# EAGLE design knightrider (EAGLE 7.2.0)
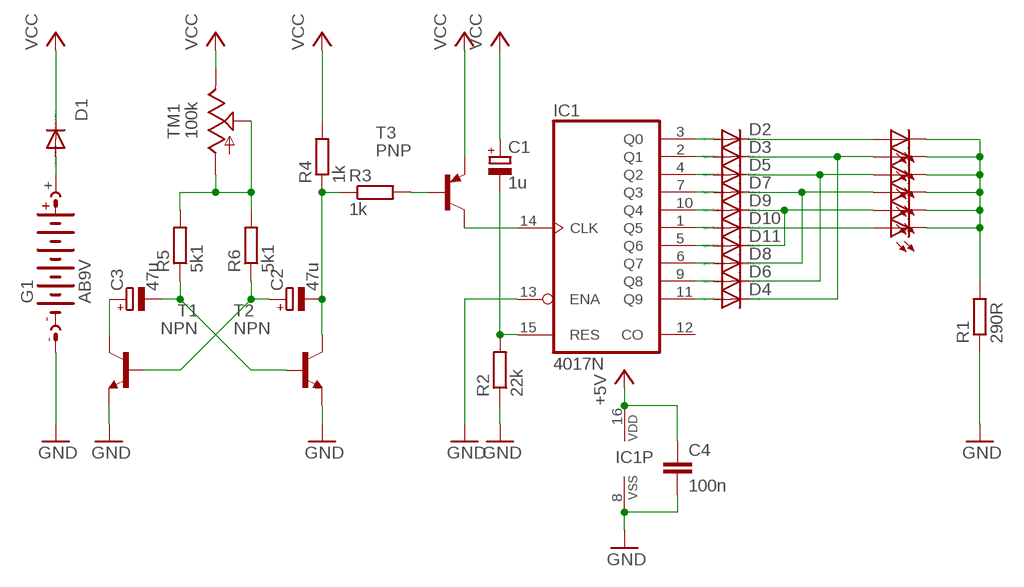
[diagram p0: schematic, sheet 1]

## Parts
C1  1u  CPOL-EUE2.5-6  [E2,5-6]
C2  47u  CPOL-EUE2.5-6  [E2,5-6]
C3  47u  CPOL-EUE2.5-6  [E2,5-6]
C4  100n  C-EU050-025X075  [C050-025X075]
D1  1N4148  1N4148DO35-7  [DO35-7]
D2  1N4148DO35-7  [DO35-7]
D3  1N4148DO35-7  [DO35-7]
D4  1N4148DO35-7  [DO35-7]
D5  1N4148DO35-7  [DO35-7]
D6  1N4148DO35-7  [DO35-7]
D7  1N4148DO35-7  [DO35-7]
D8  1N4148DO35-7  [DO35-7]
D9  1N4148DO35-7  [DO35-7]
D10  1N4148DO35-7  [DO35-7]
D11  1N4148DO35-7  [DO35-7]
G1  AB9V  [AB9V]
IC1  4017N  [DIL16]
LED1  LED5MM  [LED5MM]
LED2  LED5MM  [LED5MM]
LED3  LED5MM  [LED5MM]
LED4  LED5MM  [LED5MM]
LED5  LED5MM  [LED5MM]
LED6  LED5MM  [LED5MM]
R1  290R  R-EU_0204/7  [0204/7]
R2  22k  R-EU_0204/7  [0204/7]
R3  1k  R-EU_0204/7  [0204/7]
R4  1k  R-EU_0204/7  [0204/7]
R5  5k1  R-EU_0204/7  [0204/7]
R6  5k1  R-EU_0204/7  [0204/7]
T1  NPN  2N4401-NPN-TO92-EBC  [TO92-EBC]
T2  NPN  2N4401-NPN-TO92-EBC  [TO92-EBC]
T3  PNP  2N4403-PNP-TO92-EBC  [TO92-EBC]
TM1  100k  TRIM  [6MM]

## Nets
+5V: C1.+ C4.1 D1.C IC1.16(VDD) R4.2 T3.E TM1.E ; supply symbol labelled VCC
GND: C4.2 G1.- IC1.8(VSS) IC1.13(ENA) R1.1 R2.1 T1.E T2.E
N$1: D2.A IC1.3(Q0)
N$2: D3.A IC1.2(Q1)
N$3: D4.A IC1.11(Q9)
N$4: D5.A IC1.4(Q2)
N$5: D6.A IC1.9(Q8)
N$6: D7.A IC1.7(Q3)
N$7: D8.A IC1.6(Q7)
N$8: D9.A IC1.10(Q4)
N$9: D10.A IC1.1(Q5)
N$10: D11.A IC1.5(Q6)
N$11: D3.C D4.C LED2.A
N$12: D5.C D6.C LED3.A
N$13: D7.C D8.C LED4.A
N$14: D9.C D11.C LED5.A
N$15: D2.C LED1.A
N$16: D10.C LED6.A
N$17: LED1.K(C) LED2.K(C) LED3.K(C) LED4.K(C) LED5.K(C) LED6.K(C) R1.2
N$18: IC1.14(CLK) T3.C
N$19: C1.- IC1.15(RES) R2.2
N$20: D1.A G1.+
N$21: C3.+ T1.C
N$22: C3.- R5.1 T2.B
N$23: R3.2 T3.B
N$24: C2.- R3.1 R4.1 T2.C
N$25: C2.+ R6.1 T1.B
N$26: R5.2 R6.2 TM1.A TM1.S
Unconnected: IC1.12(CO)

## Library data of the parts
C1-C3 = rcl:CPOL-EU: POLARIZED CAPACITOR, European symbol
C4 = rcl:C-EU: CAPACITOR, European symbol
D1-D11 = diode:1N4148: DIODE high speed (Philips)
G1 = battery:AB9V: 9-V BATTERY CLIP
IC1 = 40xx:4017: COUNTER/DIVIDER
LED1-LED6 = led:LED: LED OSRAM: - CHIPLED LG R971, LG N971, LY N971, LG Q971, LY Q971, LO R971, LY R971 LH N974, LH R974 LS Q976, LO Q976, LY Q976 LO Q996 - Hyper CHIPLED LW Q18S LB Q993, LB Q99A, LB R99A - SideLED LS A670, LO A670, LY A670, LG A670, LP A670 LB A673, LV A673, LT A673, LW A673 LH A674 LY A675 LS A676, LA A676, LO A676, LY A676, LW A676 LS A679, LY A679, LG A679 - Hyper Micro SIDELED® LS Y876, LA Y876, LO Y876, LY Y876 LT Y87S - SmartLED LW L88C, LW L88S LB L89C, LB L89S, LG L890 LS L89K, LO L89K, LY L89K LS L896, LA L896, LO L896, LY L896 - TOPLED LS T670, LO T670, LY T670, LG T670, LP T670 LSG T670, LSP T670, LSY T670, LOP T670, LYG T670 LG T671, LOG T671, LSG T671 LB T673, LV T673, LT T673, LW T673 LH T674 LS T676, LA T676, LO T676, LY T676, LB T676, LH T676, LSB T676, LW T676 LB T67C, LV T67C, LT T67C, LS T67K, LO T67K, LY T67K, LW E67C LS E67B, LA E67B, LO E67B, LY E67B, LB E67C, LV E67C, LT E67C LW T67C LS T679, LY T679, LG T679 LS T770, LO T770, LY T770, LG T770, LP T770 LB T773, LV T773, LT T773, LW T773 LH T774 LS E675, LA E675, LY E675, LS T675 LS T776, LA T776, LO T776, LY T776, LB T776 LHGB T686 LT T68C, LB T68C - Hyper Mini TOPLED® LB M676 - Mini TOPLED Santana® LG M470 LS M47K, LO M47K, LY M47K Source: http://www.osram.convergy.de LUXEON: - LUMILED® LXK2-PW12-R00, LXK2-PW12-S00, LXK2-PW14-U00, LXK2-PW14-V00 LXK2-PM12-R00, LXK2-PM12-S00, LXK2-PM14-U00 LXK2-PE12-Q00, LXK2-PE12-R00, LXK2-PE12-S00, LXK2-PE14-T00, LXK2-PE14-U00 LXK2-PB12-K00, LXK2-PB12-L00, LXK2-PB12-M00, LXK2-PB14-N00, LXK2-PB14-P00, LXK2-PB14-Q00 LXK2-PR12-L00, LXK2-PR12-M00, LXK2-PR14-Q00, LXK2-PR14-R00 LXK2-PD12-Q00, LXK2-PD12-R00, LXK2-PD12-S00 LXK2-PH12-R00, LXK2-PH12-S00 LXK2-PL12-P00, LXK2-PL12-Q00, LXK2-PL12-R00 Source: www.luxeon.com KINGBRIGHT: KA-3528ASYC Source: www.kingbright.com
R1-R6 = rcl:R-EU_: RESISTOR, European symbol
T1 T2 = transistor-neu-to92:*-NPN-: NPN Transistror
T3 = transistor-neu-to92:*-PNP-: PNP Transistror
TM1 = adafruit:TRIM

## Board
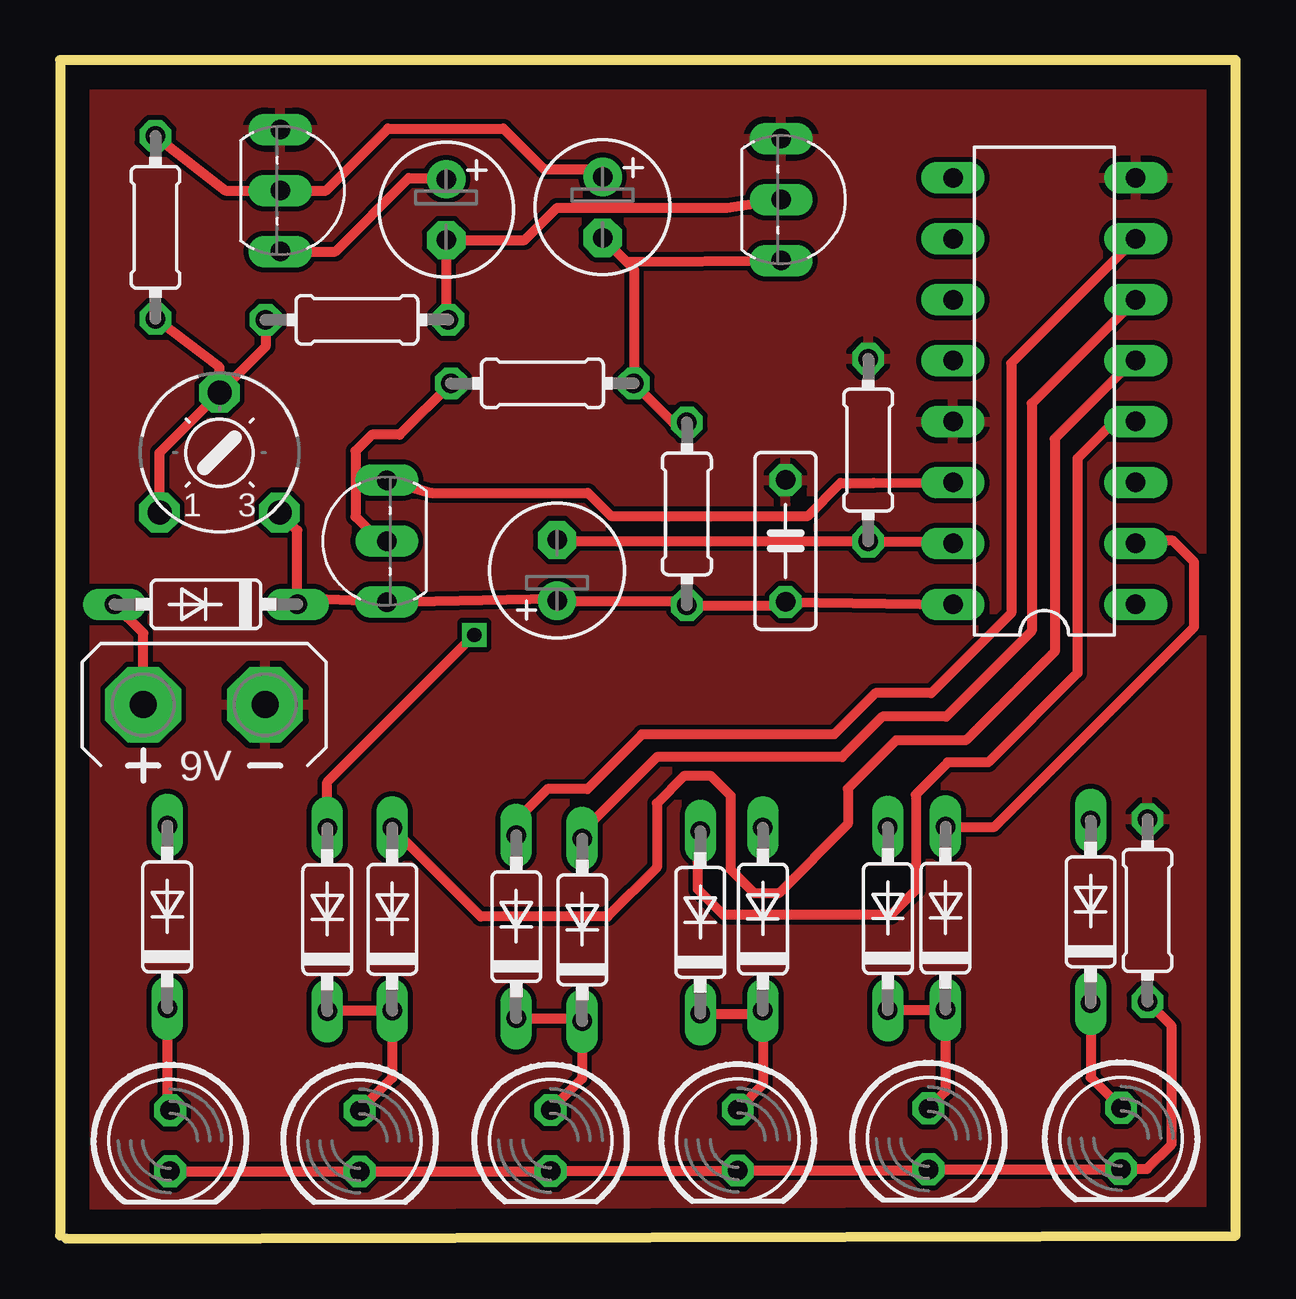
[diagram p1: board, top side]
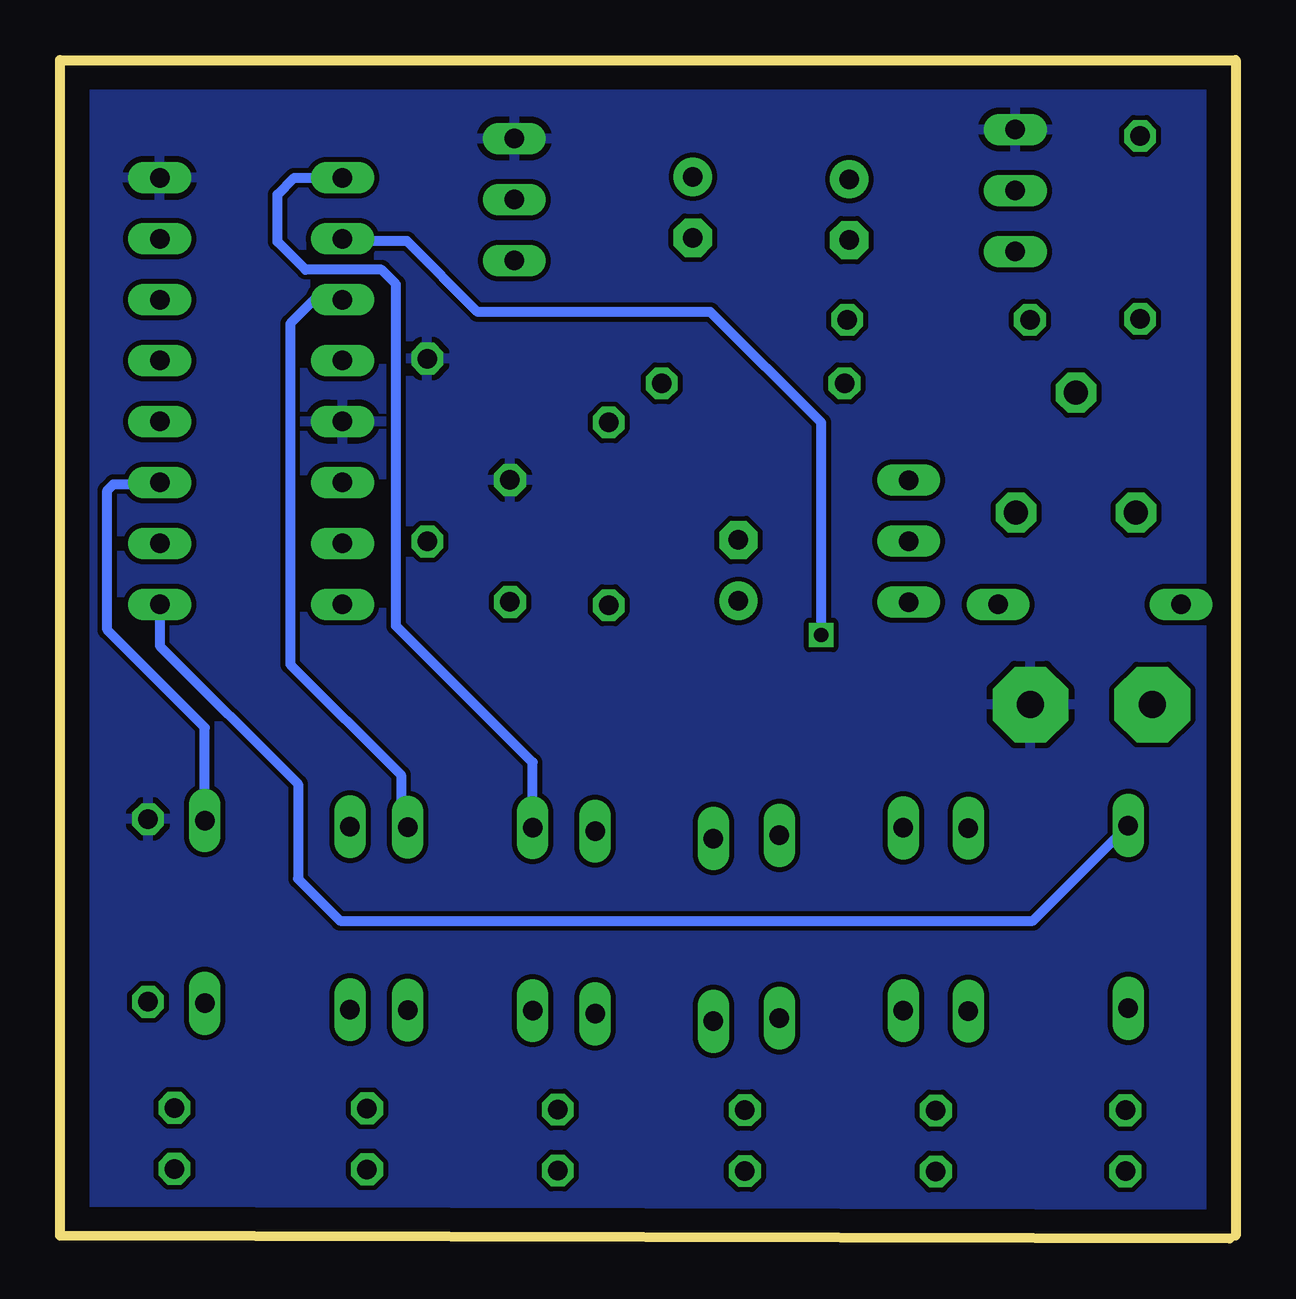
[diagram p2: board, bottom side, seen from below]

Size 49 x 49.13 mm. Coordinates in mm from the lower left corner, seen from the top.
Outline: 0.26,0 49,0.13 49,49.13 0,49.13 0,0.13
Copper layers (1*16): Top 0.035mm / dielectric 1.5mm / Bottom 0.035mm
Design rules "default": minimum track width 10mil, minimum drill 24mil, track to track 8mil, track to pad 8mil, pad to pad 8mil, via to via 8mil, smd to smd 8mil, copper to edge 40mil, drill to drill 8mil, minimum pad ring 10mil, minimum via ring 8mil, stop-mask expansion 4mil, vias tented up to drill 0mil, thermal gap 10mil

### Footprints (pad centres in the part's own frame; a part is rotated, then mirrored left to right if it is on the bottom)
E2,5-6 = drill 0.813 pad 1.6: + -1.27,0 | drill 0.813 pad 1.6 octagon: - 1.27,0
C050-025X075 = drill 0.813 octagon: 1 -2.54,0; 2 2.54,0
DO35-7 = drill 0.813 long: A 3.81,0; C -3.81,0
AB9V = drill 1.118 pad 3.15 octagon: + 0,2.54; - 0,-2.54
DIL16 = drill 0.813 long: 1 -8.89,-3.81; 2 -6.35,-3.81; 3 -3.81,-3.81; 4 -1.27,-3.81; 5 1.27,-3.81; 6 3.81,-3.81; 7 6.35,-3.81; 8 8.89,-3.81; 9 8.89,3.81; 10 6.35,3.81; 11 3.81,3.81; 12 1.27,3.81; 13 -1.27,3.81; 14 -3.81,3.81; 15 -6.35,3.81; 16 -8.89,3.81
LED5MM = drill 0.813 octagon: A -1.27,0; K 1.27,0
0204/7 = drill 0.813 octagon: 1 -3.81,0; 2 3.81,0
TO92-EBC = drill 0.813 long: B 0,-1.27; C 2.54,-1.27; E -2.54,-1.27
6MM = drill 1 pad 1.676 octagon: A -2.5,-2.5; E 2.5,-2.5; S 0,2.5

### Placement (x,y rotation side)
C1  20.72,27.85 90 top
C2  22.62,42.99 270 top
C3  16.1,42.89 270 top
C4  30.24,29.08 90 top
D1  6.08,26.44 180 top
D2  42.96,13.62 90 top
D3  36.91,13.36 90 top
D4  34.51,13.34 90 top
D5  26.69,13.18 90 top
D6  29.3,13.32 90 top
D7  19.02,13 90 top
D8  21.77,12.87 90 top
D9  11.14,13.3 90 top
D10  4.47,13.41 90 top
D11  13.85,13.31 90 top
G1  6.01,22.26 90 top
IC1  41.03,35.33 90 top
LED1  44.23,4.18 270 top
LED2  36.2,4.16 270 top
LED3  28.25,4.11 270 top
LED4  20.45,4.09 270 top
LED5  12.49,4.07 270 top
LED6  4.59,4.08 270 top
R1  45.33,13.68 270 top
R2  33.69,32.87 270 top
R3  20.11,35.65 180 top
R4  26.13,30.21 270 top
R5  12.38,38.3 180 top
R6  3.98,42.15 270 top
T1  10.45,43.69 270 top
T2  31.33,43.31 270 top
T3  12.36,29.07 90 top
TM1  6.65,32.76 0 top

### Tracks (layer width: path | path; a pad name or v marks a point on that pad's centre or on a via)
+5V
  Top 0.406: IC1.16 C4.1 30.1,26.4 R4.2 25.95,26.58 C1.+ 20.62,26.68 T3.E 10.13,26.68 D1.C 9.89,29.52 TM1.E
GND
  pour Bottom: -0.69,50.05 49.75,50.05 49.75,-1.11 -0.69,-1.11
  pour Top: -0.64,50.03 49.7,50.03 49.7,-0.72 -0.64,-0.72
N$1
  Bottom 0.406: D2.A 42.96,21.3 47.03,25.37 47.03,31.19 46.77,31.45 44.91,31.45 IC1.3
N$2
  Top 0.406: D3.A 38.95,17.17 47.28,25.5 47.28,28.2 46.39,29.09 44.95,29.09 IC1.2
N$3
  Bottom 0.406: IC1.11 38.4,39.14 39.4,38.14 39.4,23.94 34.79,19.33 34.79,17.43 D4.A
N$4
  Top 0.406: IC1.4 43.95,34.06 42.41,32.52 42.41,23.57 38.69,19.85 37.01,19.85 35.67,18.51 35.67,14.53 34.63,13.49 27.66,13.49 26.59,14.56 26.59,16.89 D5.A
N$5
  Bottom 0.406: D6.A 29.3,19.85 34.99,25.54 34.99,39.78 35.6,40.39 38.77,40.39 39.93,41.55 39.93,43.52 39.23,44.22 IC1.9
N$6
  Top 0.406: IC1.7 39.65,36.49 39.65,26.07 36.32,22.74 33.99,22.74 32.27,21.02 24.26,21.02 21.98,18.74 20.32,18.74 19.02,17.44 D7.A
N$7
  Top 0.406: IC1.6 40.51,34.81 40.51,25.33 36.94,21.76 34.29,21.76 32.6,20.07 24.88,20.07 21.77,16.96 D8.A
N$8  (via drill 0.6)
  Top 0.406: D9.A 11.14,19.03 v17.27,25.16
  Bottom 0.406: v17.27,25.16 17.27,34.01 21.89,38.63 31.59,38.63 34.54,41.58 37.12,41.58 IC1.10
N$9
  Bottom 0.406: IC1.1 44.84,24.71 39.08,18.95 39.08,15 37.33,13.25 8.44,13.25 D10.A
N$10
  Top 0.406: IC1.5 44.72,36.6 41.46,33.34 41.46,24.47 37.76,20.77 34.85,20.77 32.84,18.76 32.84,17.28 29.96,14.4 28.94,14.4 27.96,15.38 27.96,18.46 27.14,19.28 26.01,19.28 24.88,18.15 24.88,15.48 22.83,13.43 17.54,13.43 D11.A
N$11
  Top 0.406: D4.C 36.89,9.53 D3.C 36.91,6.14 LED2.A
N$12
  Top 0.406: D5.C 29.16,9.37 D6.C 29.3,6.43 LED3.A
N$13
  Top 0.406: D7.C 21.64,9.19 D8.C 21.77,6.68 LED4.A
N$14
  Top 0.406: D9.C D11.C 13.85,6.7 LED5.A
N$15
  Top 0.406: D2.C 42.96,6.72 LED1.A
N$16
  Top 0.406: D10.C 4.47,5.47 LED6.A
N$17
  Top 0.406: LED6.K LED5.K 20.96,2.8 21,2.84 20.47,2.84 LED4.K 28.23,2.82 LED3.K 36.15,2.84 LED2.K 44.21,2.89 LED1.K 45.31,2.91 46.34,3.94 46.34,8.86 R1.2
N$18
  Top 0.406: T3.C 15.49,31.08 22.01,31.08 22.96,30.13 31.17,30.13 32.54,31.5 33.92,31.5 IC1.14
N$19
  Top 0.406: C1.- 20.76,29.08 33.67,29.08 R2.2 37.14,29.06 IC1.15
N$20
  Top 0.406: G1.+ 3.47,25.24 D1.A
N$21
  Top 0.406: T1.C 11.48,41.15 14.54,44.21 16.05,44.21 C3.+
N$22
  Top 0.406: R5.1 16.1,38.39 C3.- 19.37,41.62 20.72,42.97 27.8,42.97 T2.B
N$23
  Top 0.406: R3.2 14.16,33.51 13,33.51 12.32,32.83 12.32,30.09 13.19,29.22 T3.B
N$24
  Top 0.406: C2.- 23.62,40.72 | 23.62,40.72 T2.C | 23.62,40.72 23.92,40.42 R3.1 25.55,34.02 R4.1
N$25
  Top 0.406: R6.1 6.9,43.69 T1.B 11.09,43.69 13.67,46.27 18.48,46.27 20.18,44.57 22.31,44.57 C2.+
N$26
  Top 0.406: R5.2 8.57,37.18 TM1.S | TM1.S 6.65,36.32 R6.2 | TM1.A 4.15,32.76 TM1.S

### Text on the board
tValues: C B E | C B E | C B E